# EAGLE design Gripper_Finger (EAGLE 9.6.2)
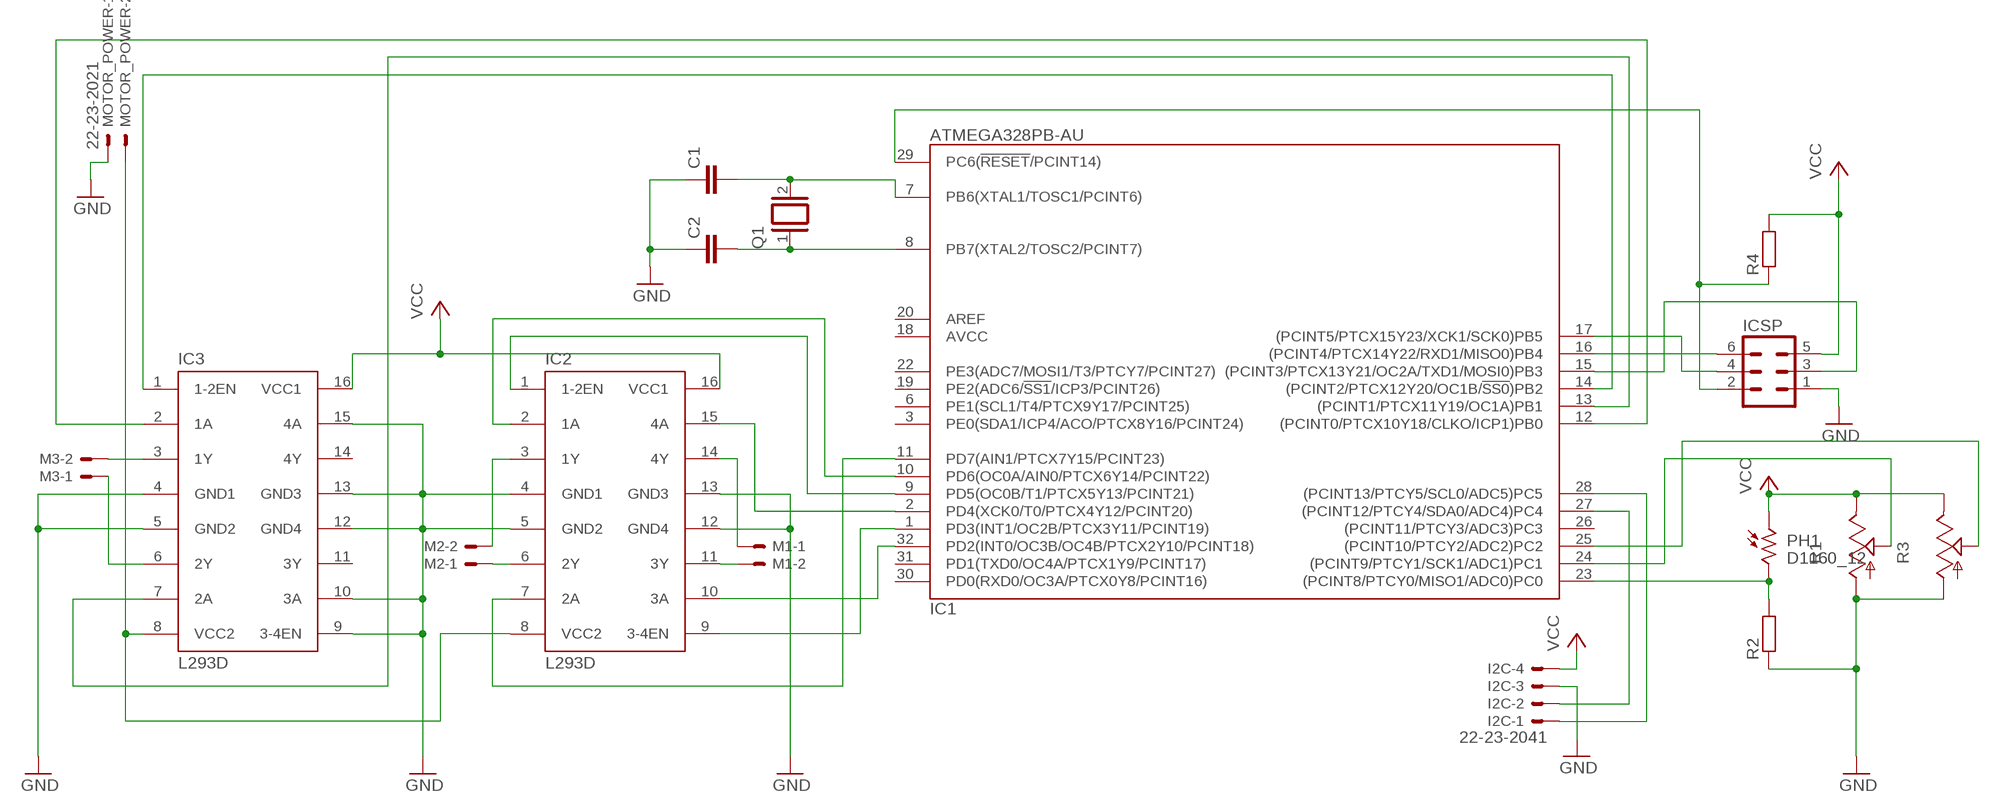
[diagram p0: schematic, sheet 1]

## Parts
C1  C2.5/2  [C2.5-2]
C2  C2.5/2  [C2.5-2]
I2C  22-23-2041  [22-23-2041]
IC1  ATMEGA328PB-AU  [QFP32_7X7_0.80]
IC2  L293D  [DIL16]
IC3  L293D  [DIL16]
ICSP  MA03-2  [MA03-2]
M1  22-23-2021  [22-23-2021]
M2  22-23-2021  [22-23-2021]
M3  22-23-2021  [22-23-2021]
MOTOR_POWER  22-23-2021  [22-23-2021]
PH1  D1160_12  [D11XX]
Q1  XTAL/S  [QS]
R1  TRIM_US-B64Y  [B64Y]
R2  R-EU_0204/5  [0204/5]
R3  TRIM_US-B64Y  [B64Y]
R4  R-EU_0204/5  [0204/5]

## Nets
CRYSTAL1: C2.2 IC1.8(PB7(XTAL2/TOSC2/PCINT7)) Q1.1
CRYSTAL2: C1.2 IC1.7(PB6(XTAL1/TOSC1/PCINT6)) Q1.2
GND: C1.1 C2.1 I2C.3 IC2.4(GND1) IC2.5(GND2) IC2.12(GND4) IC2.13(GND3) IC3.4(GND1) IC3.5(GND2) IC3.9(3-4EN) IC3.10(3A) IC3.12(GND4) IC3.13(GND3) IC3.15(4A) ICSP.1 MOTOR_POWER.1 R1.A R2.1 R3.A
LIGHT: IC1.23((PCINT8/PTCY0/MISO1/ADC0)PC0) PH1.2 R2.2
M1A [power]: IC2.14(4Y) M1.1
M1ASIG: IC1.2(PD4(XCK0/T0/PTCX4Y12/PCINT20)) IC2.15(4A)
M1B [power]: IC2.11(3Y) M1.2
M1BSIG: IC1.32(PD2(INT0/OC3B/OC4B/PTCX2Y10/PCINT18)) IC2.10(3A)
M1E: IC1.1(PD3(INT1/OC2B/PTCX3Y11/PCINT19)) IC2.9(3-4EN)
M2A [power]: IC2.3(1Y) M2.2
M2ASIG: IC1.10(PD6(OC0A/AIN0/PTCX6Y14/PCINT22)) IC2.2(1A)
M2B [power]: IC2.6(2Y) M2.1
M2BSIG: IC1.11(PD7(AIN1/PTCX7Y15/PCINT23)) IC2.7(2A)
M2E: IC1.9(PD5(OC0B/T1/PTCX5Y13/PCINT21)) IC2.1(1-2EN)
M3A [power]: IC3.6(2Y) M3.1
M3ASIG: IC1.13((PCINT1/PTCX11Y19/OC1A)PB1) IC3.7(2A)
M3B [power]: IC3.3(1Y) M3.2
M3BSIG: IC1.12((PCINT0/PTCX10Y18/CLKO/ICP1)PB0) IC3.2(1A)
M3E: IC1.14((PCINT2/PTCX12Y20/OC1B/!SS0!)PB2) IC3.1(1-2EN)
MISO: IC1.16((PCINT4/PTCX14Y22/RXD1/MISO0)PB4) ICSP.6
MOSI: IC1.15((PCINT3/PTCX13Y21/OC2A/TXD1/MOSI0)PB3) ICSP.3
MOTOR_POWER [power]: IC2.8(VCC2) IC3.8(VCC2) MOTOR_POWER.2
POT1: IC1.24((PCINT9/PTCY1/SCK1/ADC1)PC1) R1.S
POT2: IC1.25((PCINT10/PTCY2/ADC2)PC2) R3.S
RESET: IC1.29(PC6(!RESET!/PCINT14)) ICSP.2 R4.1
SCK: IC1.17((PCINT5/PTCX15Y23/XCK1/SCK0)PB5) ICSP.4
SCL: I2C.1 IC1.28((PCINT13/PTCY5/SCL0/ADC5)PC5)
SDA: I2C.2 IC1.27((PCINT12/PTCY4/SDA0/ADC4)PC4)
VCC: I2C.4 IC2.16(VCC1) IC3.16(VCC1) ICSP.5 PH1.1 R1.E R3.E R4.2
Unconnected: IC1.3(PE0(SDA1/ICP4/ACO/PTCX8Y16/PCINT24)) IC1.6(PE1(SCL1/T4/PTCX9Y17/PCINT25)) IC1.19(PE2(ADC6/!SS1!/ICP3/PCINT26)) IC1.20(AREF) IC1.22(PE3(ADC7/MOSI1/T3/PTCY7/PCINT27)) IC1.26((PCINT11/PTCY3/ADC3)PC3) IC1.30(PD0(RXD0/OC3A/PTCX0Y8/PCINT16)) IC1.31(PD1(TXD0/OC4A/PTCX1Y9/PCINT17)) IC3.11(3Y) IC3.14(4Y)

## Power pins joined to a net without a drawn wire
AVCC: IC1.18(AVCC)
GND: IC1.5(GND) IC1.21(GND)
VCC: IC1.4(VCC)

## Library data of the parts
C1 C2 = capacitor-wima:C: CAPACITOR naming: grid - package width
I2C = con-molex:22-23-2041: .100" (2.54mm) Center Header - 4 Pin; MF: MOLEX; MPN: 22-23-2041; OC_FARNELL: 1462920; OC_NEWARK: 38C0355
IC1 = atmel:ATMEGA328PB: 8-bit AVR Microcontroller 32kbytes flash 2kbytes SRAM 1kbyte EEPROM USART 8-channel 10 bit ADC
IC2 IC3 = st-microelectronics:L293D: PUSH-PULL 4 CHANNEL DRIVER; MPN: L293D; OC_FARNELL: 9589619; OC_NEWARK: 56P8249
ICSP = con-lstb:MA03-2: PIN HEADER; OC_FARNELL: unknown; OC_NEWARK: unknown
M1-M3 MOTOR_POWER = con-molex:22-23-2021: .100" (2.54mm) Center Header - 2 Pin; MF: MOLEX; MPN: 22-23-2021; OC_FARNELL: 1462926; OC_NEWARK: 25C3832
PH1 = photo-elements:D11: Photo Sensor Oil Burner Control Applications Source: http://optoelectronics.perkinelmer.com/content/Datasheets/DTS_PhotocellsD1160.pdf
Q1 = special:XTAL/S: CRYSTAL
R1 R3 = pot:TRIM_US-: POTENTIOMETER
R2 R4 = rcl:R-EU_: RESISTOR, European symbol; SPICEPREFIX: R

## Net classes
0 default: width 0.508 mm, drill 0.6 mm, clearance 0.152 mm
1 power: width 0.762 mm, drill 0.6 mm, clearance 0.152 mm

## Board
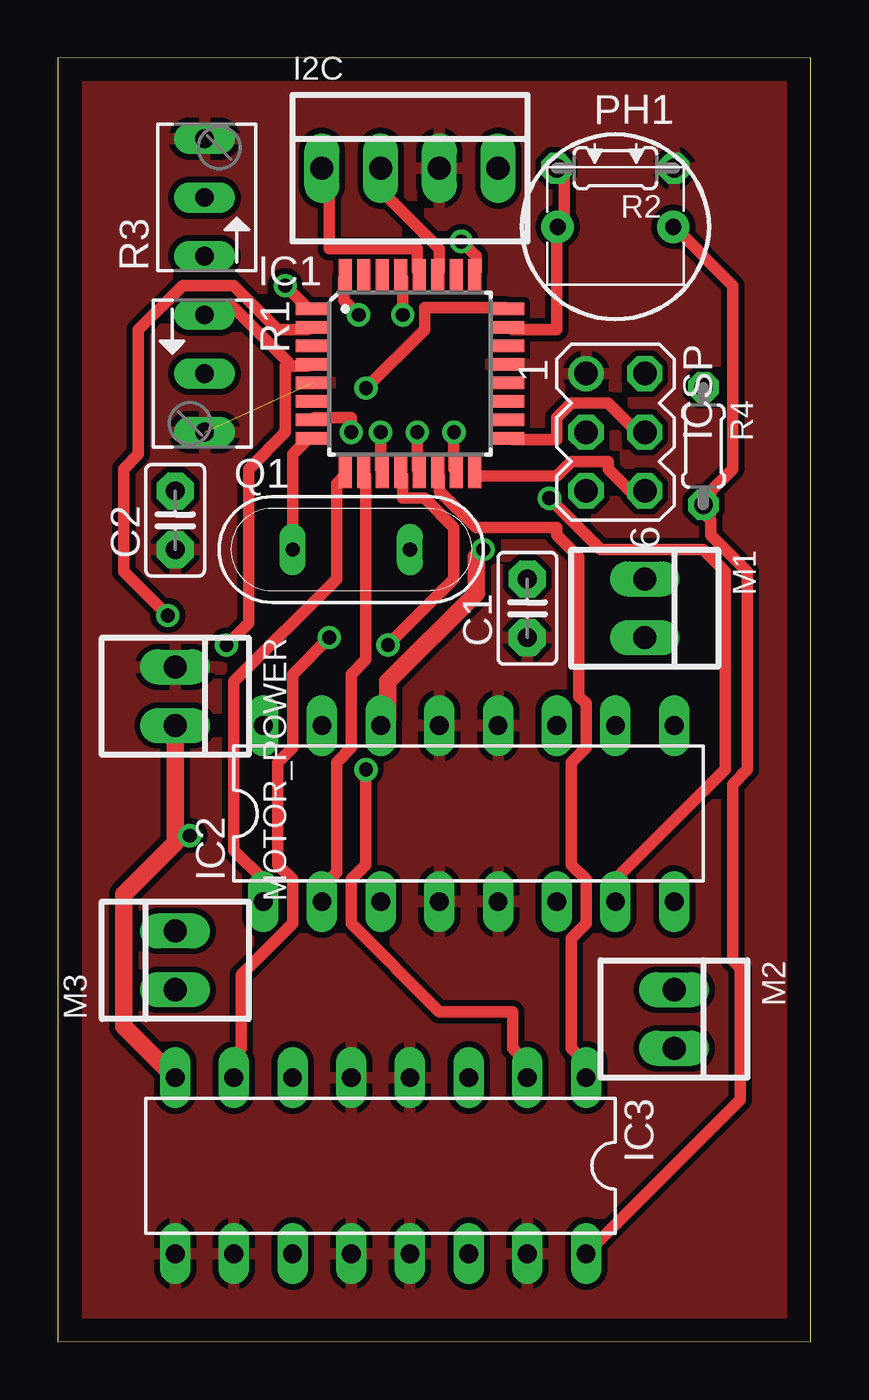
[diagram p1: board, top side]
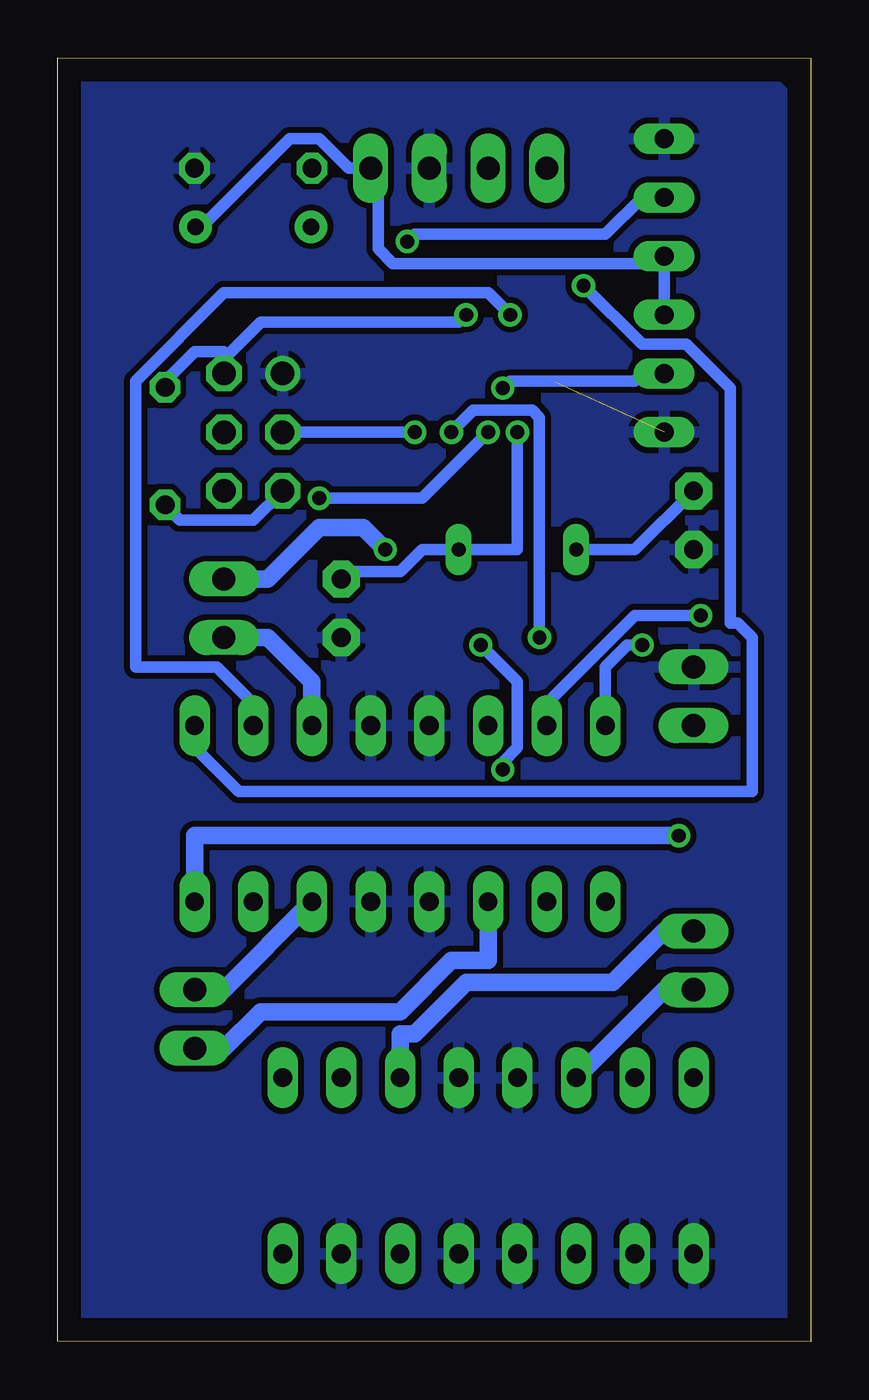
[diagram p2: board, bottom side, seen from below]

Size 32.59 x 55.58 mm. Coordinates in mm from the lower left corner, seen from the top.
Outline: 0,0 32.59,0.03 32.59,55.58 0,55.55 0,0
Copper layers (1*16): Top 0.035mm / dielectric 1.5mm / Bottom 0.035mm
Design rules "default": minimum track width 6mil, minimum drill 0.35mm, track to track 6mil, track to pad 6mil, pad to pad 6mil, via to via 6mil, smd to smd 6mil, copper to edge 40mil, drill to drill 6mil, minimum pad ring 10mil, minimum via ring 8mil, stop-mask expansion 4mil, vias tented up to drill 0mil, thermal gap 10mil

### Footprints (pad centres in the part's own frame; a part is rotated, then mirrored left to right if it is on the bottom)
C2.5-2 = drill 0.813 pad 1.6 octagon: 1 -1.27,0; 2 1.27,0
22-23-2041 = drill 1 long: 1 -3.81,0; 2 -1.27,0; 3 1.27,0; 4 3.81,0
QFP32_7X7_0.80 = smd 1.5 x 0.55: 1 -4.2,2.8; 2 -4.2,2; 3 -4.2,1.2; 4 -4.2,0.4; 5 -4.2,-0.4; 6 -4.2,-1.2; 7 -4.2,-2; 8 -4.2,-2.8; 17 4.2,-2.8; 18 4.2,-2; 19 4.2,-1.2; 20 4.2,-0.4; 21 4.2,0.4; 22 4.2,1.2; 23 4.2,2; 24 4.2,2.8 | smd 0.55 x 1.5: 9 -2.8,-4.2; 10 -2,-4.2; 11 -1.2,-4.2; 12 -0.4,-4.2; 13 0.4,-4.2; 14 1.2,-4.2; 15 2,-4.2; 16 2.8,-4.2; 25 2.8,4.2; 26 2,4.2; 27 1.2,4.2; 28 0.4,4.2; 29 -0.4,4.2; 30 -1.2,4.2; 31 -2,4.2; 32 -2.8,4.2
DIL16 = drill 0.813 long: 1 -8.89,-3.81; 2 -6.35,-3.81; 3 -3.81,-3.81; 4 -1.27,-3.81; 5 1.27,-3.81; 6 3.81,-3.81; 7 6.35,-3.81; 8 8.89,-3.81; 9 8.89,3.81; 10 6.35,3.81; 11 3.81,3.81; 12 1.27,3.81; 13 -1.27,3.81; 14 -3.81,3.81; 15 -6.35,3.81; 16 -8.89,3.81
MA03-2 = drill 1.016: 1 -2.54,-1.27 | drill 1.016 octagon: 2 -2.54,1.27; 3 0,-1.27; 4 0,1.27; 5 2.54,-1.27; 6 2.54,1.27
22-23-2021 = drill 1 long: 1 -1.27,0; 2 1.27,0
D11XX = drill 0.7 pad 1.4: 1 -2.5,0; 2 2.5,0
QS = drill 0.61 long: 1 -2.54,0; 2 2.54,0
B64Y = drill 0.813 long: A 2.54,0; E -2.54,0; S 0,0
0204/5 = drill 0.813 octagon: 1 -2.54,0; 2 2.54,0

### Placement (x,y rotation side)
C1  20.32,31.75 90 top
C2  5.08,35.56 90 top
I2C  15.24,50.8 0 top
IC1  15.24,41.91 0 top
IC2  17.78,22.86 0 top
IC3  13.97,7.62 180 top
ICSP  24.13,39.37 270 top
M1  25.4,31.75 270 top
M2  26.67,13.97 270 top
M3  5.08,16.51 90 top
MOTOR_POWER  5.08,27.94 270 top
PH1  24.13,48.26 180 top
Q1  12.7,34.29 0 top
R1  6.35,41.91 270 top
R2  24.13,50.8 180 top
R3  6.35,49.53 90 top
R4  27.94,38.77 270 top

### Tracks (layer width: path | path; a pad name or v marks a point on that pad's centre or on a via)
CRYSTAL1
  Top 0.508: Q1.1 10.16,38.42 10.79,39.05 IC1.8
  Bottom 0.508: C2.2 7.62,34.29 Q1.1
CRYSTAL2  (via drill 0.6)
  Top 0.508: v12.7,39.37 12.7,40 11.11,40 IC1.7
  Bottom 0.508: v12.7,39.37 12.7,34.29 Q1.2 16.83,34.29 17.78,33.34 20,33.34 C1.2
GND  (1 unrouted)
  pour Top (isolate 0.254): 1.2,-5.08 1.2,58.98 34.8,58.98 34.8,-5.08
  pour Bottom (isolate 0.254): -0.86,-5.08 -0.86,52.01 6.19,59.06 29.26,59.06 33.31,55.01 33.31,-5.08
  cutout Top: 12.11,45.02 18.41,45.02 18.41,38.92 12.11,38.92
LIGHT
  Top 0.508: IC1.23 19.68,43.81 21.59,43.81 21.59,48.26 PH1.2 21.91,48.26 21.91,50.48 R2.2
M1A  (via drill 0.6)
  Top 0.762: IC2.14 14.29,26.99 14.29,28.57 18.1,32.39 18.1,33.97 v18.41,34.29
  Bottom 0.762: v18.41,34.29 19.37,35.24 21.27,35.24 23.49,33.02 M1.1
M1ASIG  (via drill 0.6)
  Top 0.508: v4.76,31.43 2.86,33.34 2.86,37.78 3.49,38.42 3.49,43.81 5.4,45.72 7.62,45.72 9.52,43.81 10.79,43.81 IC1.2
  Bottom 0.508: v4.76,31.43 7.62,31.43 11.43,27.62 IC2.15
M1B
  Bottom 0.762: IC2.11 21.59,28.57 23.49,30.48 M1.2
M1BSIG  (via drill 0.6)
  Top 0.508: v13.02,44.45 12.38,45.08 12.38,46.04 IC1.32
  Bottom 0.508: v13.02,44.45 13.97,45.4 25.4,45.4 29.21,41.59 29.21,29.21 25.72,29.21 24.13,27.62 IC2.10
M1E  (via drill 0.6)
  Top 0.508: v9.84,45.72 10.79,44.77 IC1.1
  Bottom 0.508: v9.84,45.72 7.3,43.18 5.4,43.18 3.49,41.27 3.49,31.11 3.17,31.11 2.54,30.48 2.54,23.81 24.77,23.81 26.67,25.72 IC2.9
M2A
  Bottom 0.762: IC2.3 13.97,16.51 15.56,16.51 17.78,14.29 23.81,14.29 25.4,12.7 M2.2
M2ASIG
  Top 0.508: IC2.2 11.43,19.68 12.06,20.32 12.06,25.08 12.7,25.72 12.7,28.89 13.34,29.53 13.34,37.46 IC1.10
M2B
  Bottom 0.762: IC2.6 25.4,15.24 M2.1
M2BSIG  (via drill 0.6)
  Top 0.508: v13.97,39.37 13.97,37.78 IC1.11 | v21.27,36.51 23.49,34.29 27.94,34.29 28.89,33.34 28.89,24.76 24.13,20 IC2.7
  Bottom 0.508: v13.97,39.37 16.83,36.51 v21.27,36.51
M2E
  Top 0.508: IC2.1 8.89,20 7.62,21.27 7.62,28.57 12.06,33.02 12.06,37.15 12.38,37.46 IC1.9
M3A
  Bottom 0.762: IC3.6 6.35,15.24 M3.1
M3ASIG  (via drill 0.6)
  Top 0.508: v15.56,39.37 15.56,37.78 IC1.13 | v11.75,30.48 10.16,28.89 10.16,25.72 9.52,25.08 9.52,20.64 10.16,20 10.16,18.1 7.94,15.87 7.94,12.7 7.62,12.38 IC3.7
  Bottom 0.508: v15.56,39.37 14.61,40.32 12.06,40.32 11.75,40 v11.75,30.48
M3B
  Bottom 0.762: IC3.3 17.78,13.33 17.14,13.33 14.92,15.56 8.57,15.56 6.35,17.78 M3.2
M3BSIG  (via drill 0.6)
  Top 0.508: v14.29,30.16 17.14,33.02 17.14,35.24 15.88,36.51 14.92,36.51 14.92,37.46 IC1.12 | v13.34,24.76 13.34,20.64 12.7,20 12.7,18.1 16.51,14.29 19.68,14.29 19.68,12.7 20.32,12.07 IC3.2
  Bottom 0.508: v14.29,30.16 12.7,28.57 12.7,25.72 13.34,25.08 v13.34,24.76
M3E
  Top 0.508: IC3.1 22.86,12.07 22.22,12.7 22.22,17.46 22.86,18.1 22.86,20 22.22,20.64 22.22,25.08 22.86,25.72 22.86,27.62 22.54,27.94 22.54,33.97 21.59,34.92 21.59,35.24 18.1,35.24 16.51,36.83 16.51,37.46 IC1.14
MISO
  Top 0.508: ICSP.6 24.77,36.83 23.81,37.78 23.81,38.1 22.22,38.1 21.59,37.46 18.1,37.46 IC1.16
MOSI  (via drill 0.6)
  Top 0.508: v17.14,39.37 17.14,37.78 IC1.15
  Bottom 0.508: ICSP.3 v17.14,39.37
MOTOR_POWER  (via drill 0.6)
  Top 0.762: IC3.8 2.86,13.65 2.86,19.37 5.08,21.59 5.08,21.91 | MOTOR_POWER.2 5.08,21.91 | v5.71,21.91 5.08,21.91
  Bottom 0.762: IC2.8 26.67,21.91 v5.71,21.91
POT1  (via drill 0.6)
  Top 0.508: v13.34,41.27 15.88,43.81 15.88,44.77 19.37,44.77 IC1.24
  Bottom 0.508: v13.34,41.27 13.02,41.59 7.62,41.59 7.3,41.91 R1.S
POT2  (via drill 0.6)
  Top 0.508: v17.46,47.62 18.1,46.99 18.1,46.35 IC1.25
  Bottom 0.508: v17.46,47.62 17.14,47.94 8.89,47.94 7.3,49.53 R3.S
RESET  (via drill 0.6)
  Top 0.508: v14.92,44.45 14.92,46.04 IC1.29
  Bottom 0.508: v14.92,44.45 15.24,44.13 23.81,44.13 25.24,42.7 | 25.24,42.7 25.4,42.55 ICSP.2 | R4.1 27.94,41.59 26.67,42.86 25.4,42.86 25.24,42.7
SCK
  Top 0.508: ICSP.4 25.08,39.37 23.81,40.64 22.22,40.64 21.59,40 21.59,39.05 19.68,39.05 IC1.17
SCL
  Top 0.508: I2C.1 11.75,50.48 11.75,47.31 15.56,47.31 15.56,46.35 IC1.28
SDA
  Top 0.508: I2C.2 13.97,49.85 16.51,47.31 16.51,46.35 IC1.27
VCC  (via drill 0.6)
  Top 0.508: 10,42.39 7.62,44.77 6.35,44.77 R1.E | 10,42.39 10.16,42.23 10.79,42.23 IC1.4 | v7.3,30.16 8.25,31.11 8.25,37.78 9.84,39.37 9.84,42.23 10,42.39 | IC3.16 29.53,10.48 29.53,16.19 29.21,16.51 29.21,24.13 29.84,24.76 29.84,33.34 28.26,34.92 28.26,35.56 27.94,35.88 R4.2 28.26,35.88 28.26,36.83 29.21,37.78 29.21,45.72 26.67,48.26 PH1.1
  Bottom 0.508: IC2.16 8.89,29.21 7.94,30.16 v7.3,30.16 | R1.E 6.35,46.67 | PH1.1 26.35,48.26 22.54,52.07 21.27,52.07 20,50.8 I2C.4 18.73,50.8 18.73,47.31 18.1,46.67 6.35,46.67 | ICSP.5 24.13,35.56 27.3,35.56 27.94,36.19 R4.2 | 6.35,46.67 R3.E